# Altium schematic sheet UPCNSL-ABS-COMMS-RFPATEST-v1.0.SchDoc
size A3
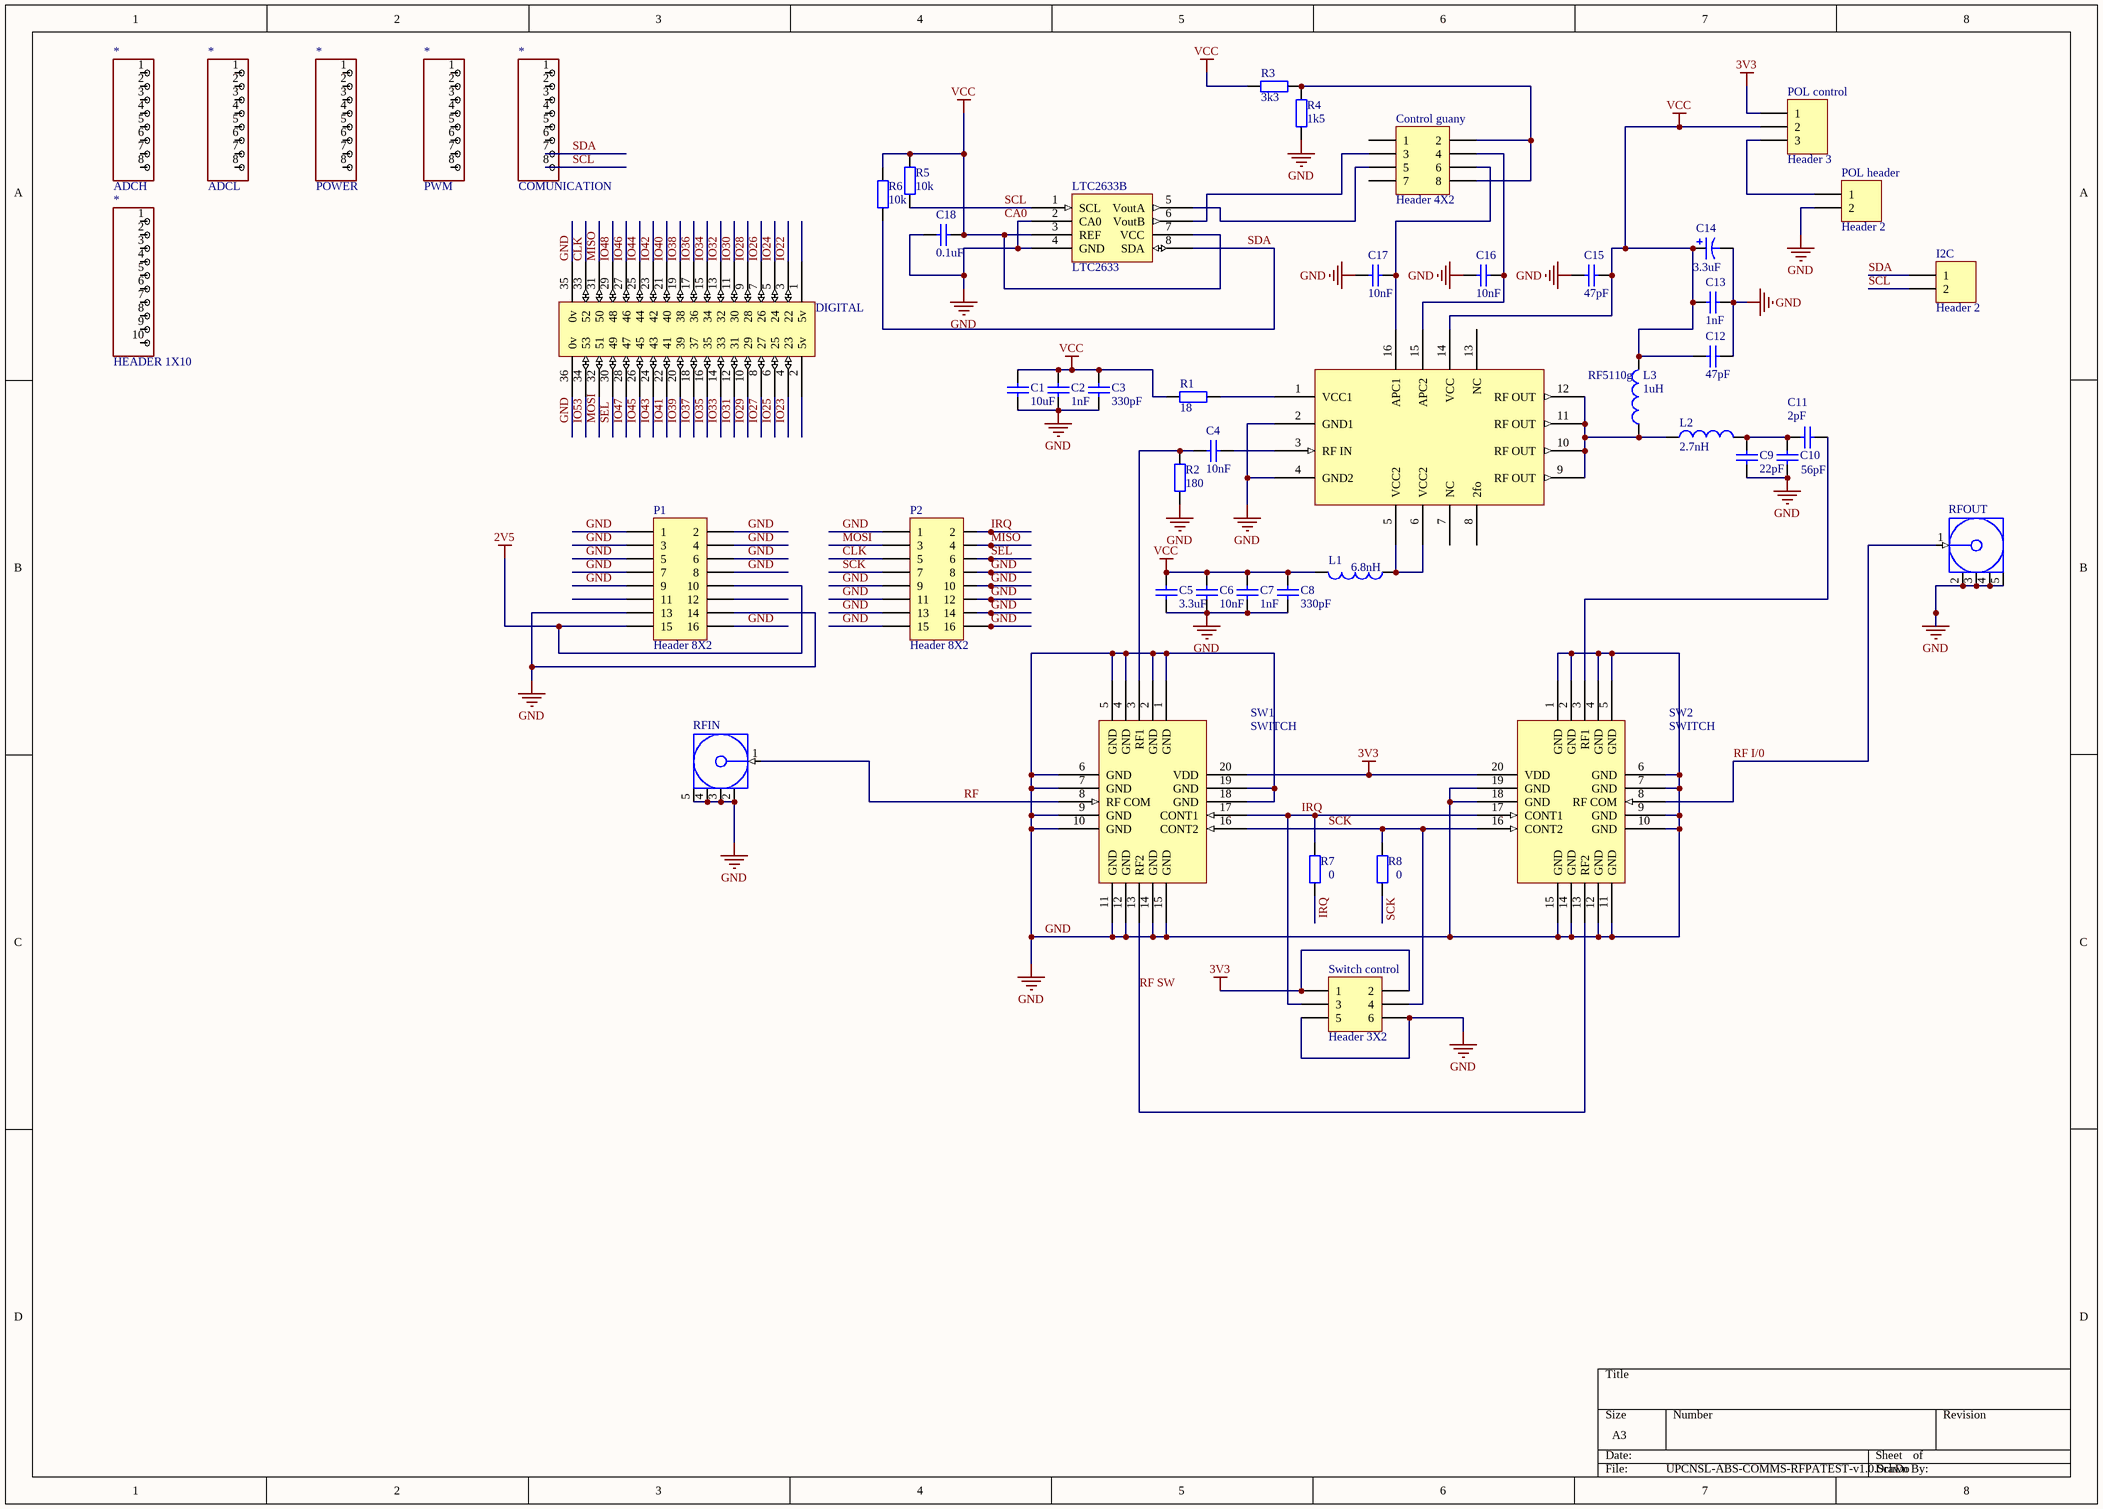
[diagram p0: UPCNSL-ABS-COMMS-RFPATEST-v1.0.SchDoc]

## Parts
(Parts that share a designator on the sheet are numbered #1, #2 ... from top to bottom, then left to right.)
*#1  ADCH  [ADCH]
*#2  ADCL  [ADCH]
*#3  POWER  [ADCH]
*#4  PWM  [ADCH]
*#5  COMUNICATION  [ADCH]
*#6  HEADER 1X10  [HEADER 1X10]
C1  value 10uF  [CAP0603]  (hidden comment: CAP0603)
C2  value 1nF  [CAP0603]  (hidden comment: CAP0603)
C3  value 330pF  [CAP0603]  (hidden comment: CAP0603)
C4  value 10nF  [CAP0603]  (hidden comment: CAP0603)
C5  value 3.3uF  [CAP0603]  (hidden comment: CAP0603)
C6  value 10nF  [CAP0603]  (hidden comment: CAP0603)
C7  value 1nF  [CAP0603]  (hidden comment: CAP0603)
C8  value 330pF  [CAP0603]  (hidden comment: CAP0603)
C9  value 22pF  [CAP0603]  (hidden comment: CAP0603)
C10  value 2pF  [CAP0603]  (hidden comment: CAP0603)
C11  value 56pF  [CAP0603]  (hidden comment: CAP0603)
C12  value 47pF  [CAP0603]  (hidden comment: CAP0603)
C13  value 1nF  [CAP0603]  (hidden comment: CAP0603)
C14  value 3.3uF  [CAP0603]
C15  value 47pF  [CAP0603]  (hidden comment: CAP0603)
C16  value 10nF  [CAP0603]  (hidden comment: CAP0603)
C17  value 10nF  [CAP0603]  (hidden comment: CAP0603)
C18  value 0.1uF  [CAP0603]  (hidden comment: CAP0603)
Control_guany  Header 4X2  [HDR2X4]
DIGITAL  IO_36  [HEADER 2X18]  (value not drawn)
I2C  Header 2  [HDR1X2]
L1  value 6.8nH  [CAP0603]  (hidden comment: LT2)
L2  value 2.7nH  [CAP0603]  (hidden comment: LT2)
L3  value 1uH  [NR3012 - duplicate]  (hidden comment: LT2)
LTC2633  LTC2633  [LTC2633 - duplicate1]  (part B of 2)
P1  Header 8X2  [AX5043 - duplicate]
P2  Header 8X2  [AX5043 - duplicate]
POL_control  Header 3  [HDR1X3]
POL_header  Header 2  [HDR1X2]
R1  value 18  [RES0603]  (hidden comment: RES0603)
R2  value 180  [RES0603]  (hidden comment: RES0603)
R3  value 3k3  [RES0603]  (hidden comment: RES0603)
R4  value 1k5  [RES0603]  (hidden comment: RES0603)
R5  value 10k  [RES0603]  (hidden comment: RES0603)
R6  value 10k  [RES0603]  (hidden comment: RES0603)
R7  value 0  [0603]  (hidden comment: RES0603)
R8  value 0  [0603]  (hidden comment: RES0603)
RF5110g  RF5110g  [RF5110g - duplicate3]
RFIN  ANTENNA  [MCX5.08-H5]  (value not drawn)
RFOUT  ANTENNA  [MCX5.08-H5]  (value not drawn)
SW1  SWITCH  [Switch]
SW2  SWITCH  [Switch]
Switch_control  Header 3X2  [HDR2X3]

## Nets
2V5: P1.10 P1.15
3V3: POL_control.1 SW1.20(VDD) SW2.20(VDD) Switch_control.1 Switch_control.2
GND: C1.1 C2.1 C3.1 C5.1 C6.1 C7.1 C8.1 C9.1 C10.1 C12.1 C13.1 C14.2 C15.2 C16.2 C17.2 C18.2 DIGITAL.35(0v) DIGITAL.36(0v) LTC2633.2(CA0) LTC2633.4(GND) P1.1 P1.2 P1.3 P1.4 P1.5 P1.6 P1.7 P1.8 P1.9 P1.13 P1.14 P1.16 P2.1 P2.8 P2.9 P2.10 P2.11 P2.12 P2.13 P2.14 P2.15 P2.16 POL_header.2 R2.1 R4.1 RF5110g.2(GND1) RF5110g.4(GND2) RFIN.2(GND) RFIN.3(GND) RFIN.4(GND) RFIN.5(GND) RFOUT.2(GND) RFOUT.3(GND) RFOUT.4(GND) RFOUT.5(GND) SW1.1(GND) SW1.2(GND) SW1.4(GND) SW1.5(GND) SW1.6(GND) SW1.7(GND) SW1.9(GND) SW1.10(GND) SW1.11(GND) SW1.12(GND) SW1.14(GND) SW1.15(GND) SW1.18(GND) SW1.19(GND) SW2.1(GND) SW2.2(GND) SW2.4(GND) SW2.5(GND) SW2.6(GND) SW2.7(GND) SW2.9(GND) SW2.10(GND) SW2.11(GND) SW2.12(GND) SW2.14(GND) SW2.15(GND) SW2.18(GND) SW2.19(GND) Switch_control.5 Switch_control.6
VCC: C1.2 C2.2 C3.2 C5.2 C6.2 C7.2 C8.2 C12.2 C13.2 C14.1 C15.1 C18.1 L1.2 L3.2 LTC2633.3(REF) LTC2633.7(VCC) POL_control.2 R1.1 R3.1 R5.2 R6.2 RF5110g.14(VCC)
CLK: DIGITAL.33(52) P2.5
IO22: DIGITAL.3(22)
IO23: DIGITAL.4(23)
IO24: DIGITAL.5(24)
IO25: DIGITAL.6(25)
IO26: DIGITAL.7(26)
IO27: DIGITAL.8(27)
IO28: DIGITAL.9(28)
IO29: DIGITAL.10(29)
IO30: DIGITAL.11(30)
IO31: DIGITAL.12(31)
IO32: DIGITAL.13(32)
IO33: DIGITAL.14(33)
IO34: DIGITAL.15(34)
IO35: DIGITAL.16(35)
IO36: DIGITAL.17(36)
IO37: DIGITAL.18(37)
IO38: DIGITAL.19(38)
IO39: DIGITAL.20(39)
IO40: DIGITAL.21(40)
IO41: DIGITAL.22(41)
IO42: DIGITAL.23(42)
IO43: DIGITAL.24(43)
IO44: DIGITAL.25(44)
IO45: DIGITAL.26(45)
IO46: DIGITAL.27(46)
IO47: DIGITAL.28(47)
IO48: DIGITAL.29(48)
IO53: DIGITAL.34(53)
IRQ: P2.2 R7.1 R7.2 SW1.17(CONT1) SW2.17(CONT1) Switch_control.3
MISO: DIGITAL.31(50) P2.4
MOSI: DIGITAL.32(51) P2.3
RF: RFIN.1(Signal) SW1.8(RF_COM)
RF I/0: RFOUT.1(Signal) SW2.8(RF_COM)
RF SW: SW1.13(RF2) SW2.13(RF2)
SCK: P2.7 R8.1 R8.2 SW1.16(CONT2) SW2.16(CONT2) Switch_control.4
SCL: *#5.8 I2C.2 LTC2633.1(SCL) R5.1
SDA: *#5.7 I2C.1 LTC2633.8(SDA) R6.1
SEL: DIGITAL.30(49) P2.6
NetC4_1: C4.1 RF5110g.3(RF_IN)
NetC4_2: C4.2 R2.2 SW1.3(RF1)
NetC9_2: C9.2 C10.2 C11.2 L2.2
NetC11_1: C11.1 SW2.3(RF1)
NetC16_1: C16.1 Control_guany.4 RF5110g.15(APC2)
NetC17_1: C17.1 Control_guany.6 RF5110g.16(APC1)
NetControl_guany_2: Control_guany.2 Control_guany.8 R3.2 R4.2
NetControl_guany_3: Control_guany.3 LTC2633.6(VoutB)
NetControl_guany_5: Control_guany.5 LTC2633.5(VoutA)
NetL1_1: L1.1 RF5110g.5(VCC2) RF5110g.6(VCC2)
NetL2_1: L2.1 L3.1 RF5110g.9(RF_OUT) RF5110g.10(RF_OUT) RF5110g.11(RF_OUT) RF5110g.12(RF_OUT)
NetPOL_control_3: POL_control.3 POL_header.1
NetR1_2: R1.2 RF5110g.1(VCC1)

Not connected (* = marked no-connect by the designer): *#1 1 2 3 4 5 6 7 8; *#2 1 2 3 4 5 6 7 8; *#3 1 2 3 4 5 6 7 8; *#4 1 2 3 4 5 6 7 8; *#5 1 2 3 4 5 6; *#6 1 2 3 4 5 6 7 8 9 10; Control_guany 1 7; DIGITAL 1(5v) 2(5v); P1 11 12; RF5110g 7(NC) 8(2fo) 13(NC)

## Notes on the sheet
- Labels drawn without touching a wire or pin: CA0

## Library data of the parts
*#1-*#5 = HEADER 1X8
C1-C13 C15-C18 = CAP0603: Capacitor
C14 = Cap Pol1: Polarized Capacitor (Radial); Published: 8-Jun-2000; LatestRevisionDate: 17-Jul-2002; LatestRevisionNote: Re-released for DXP Platform.; PackageReference: RB7.6-15; Publisher: Altium Limited; PackageDescription: Polarized Capacitor (Radial); 2 Leads
Control_guany = Header 4X2: Header, 4-Pin, Dual row; LatestRevisionDate: 17-Jul-2002; LatestRevisionNote: Re-released for DXP Platform.; Publisher: Altium Limited
I2C POL_header = Header 2: Header, 2-Pin; LatestRevisionDate: 17-Jul-2002; LatestRevisionNote: Re-released for DXP Platform.; Publisher: Altium Limited
L1-L3 = Inductor: Code_IEC: 1005; Published: 8-Jun-2000; LatestRevisionDate: 29-May-2009; LatestRevisionNote: IPC-7351 Footprint Added.; PackageReference: 0402-A; Publisher: Altium Limited; PackageDescription: Chip Inductor; Code_JEITA: 0402
P1 P2 = Header 8X2: Header, 8-Pin, Dual row; LatestRevisionDate: 17-Jul-2002; LatestRevisionNote: Re-released for DXP Platform.; Publisher: Altium Limited
POL_control = Header 3: Header, 3-Pin; LatestRevisionDate: 17-Jul-2002; LatestRevisionNote: Re-released for DXP Platform.; Publisher: Altium Limited
R1-R8 = RES0603: Resistor
RF5110g = RF5110g: RF Power Amplifier
RFIN RFOUT = COAX-F: RF Coaxial PCB Connector, MCX; Thru-Hole, Right-Angle Mount Socket, Blunt Post Terminal, 50 Ohm Impedance; PCB_Layout: Complies with manufacturer's recommendation.; DrillSize: Corresponds to nominal value.; Published: 15-Jul-2004; LatestRevisionDate: 15-Jul-2004; LatestRevisionNote: Component Replaced.; DatasheetDocument: 30-May-2003; PackageDocument: 04-Jul-1999; PackageReference: 919-119J-51AX; Publisher: Altium Limited; ComponentLink1Description: Manufacturer Link; ComponentLink1URL: http://www.amphenolrf.com/
Switch_control = Header 3X2: Header, 3-Pin, Dual row; LatestRevisionDate: 17-Jul-2002; LatestRevisionNote: Re-released for DXP Platform.; Publisher: Altium Limited